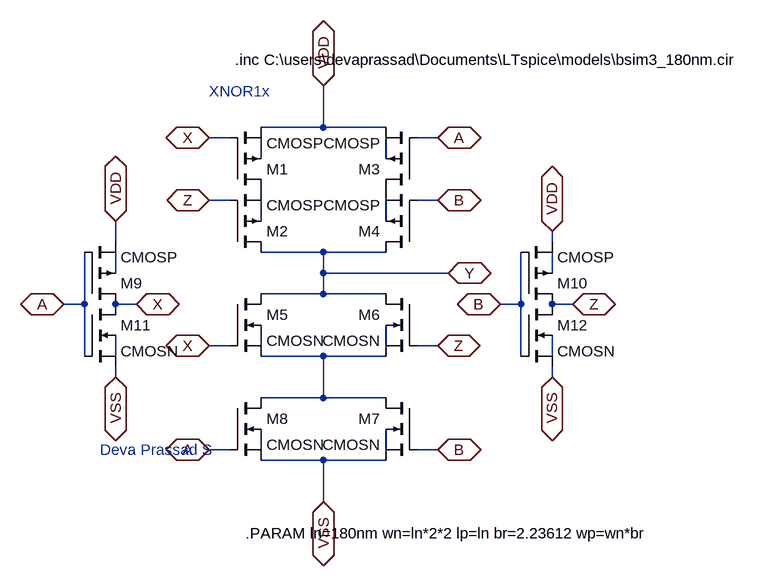
[diagram p0: schematic xnor1x.asc]
xnor1x.asc, the LTspice schematic file:
Version 4.1
SHEET 1 880 756
WIRE 96 96 96 32
WIRE 96 96 0 96
WIRE 192 96 96 96
WIRE -48 112 -80 112
WIRE 272 112 240 112
WIRE 0 144 0 112
WIRE 192 144 192 112
WIRE -48 208 -80 208
WIRE 272 208 240 208
WIRE 0 240 0 208
WIRE 192 240 192 208
WIRE -224 272 -224 240
WIRE 448 272 448 256
WIRE 96 288 0 288
WIRE 192 288 96 288
WIRE -224 320 -224 288
WIRE 96 320 96 288
WIRE 288 320 96 320
WIRE 448 320 448 288
WIRE 96 352 96 320
WIRE 96 352 0 352
WIRE 192 352 96 352
WIRE -272 368 -272 288
WIRE -272 368 -304 368
WIRE -192 368 -224 368
WIRE 400 368 400 288
WIRE 400 368 368 368
WIRE 480 368 448 368
WIRE -48 432 -80 432
WIRE 0 432 0 400
WIRE 192 432 192 400
WIRE 272 432 240 432
WIRE -272 448 -272 368
WIRE -224 448 -224 416
WIRE 96 448 0 448
WIRE 192 448 96 448
WIRE 400 448 400 368
WIRE 448 448 448 416
WIRE -224 480 -224 464
WIRE 448 480 448 464
WIRE 96 512 96 448
WIRE 96 512 0 512
WIRE 192 512 96 512
WIRE -48 592 -80 592
WIRE 0 592 0 560
WIRE 192 592 192 560
WIRE 272 592 240 592
WIRE 96 608 0 608
WIRE 192 608 96 608
WIRE 96 672 96 608
FLAG 288 320 Y
IOPIN 288 320 BiDir
FLAG 96 32 VDD
IOPIN 96 32 BiDir
FLAG 96 672 VSS
IOPIN 96 672 BiDir
FLAG -192 368 X
IOPIN -192 368 BiDir
FLAG -224 240 VDD
IOPIN -224 240 BiDir
FLAG -224 480 VSS
IOPIN -224 480 BiDir
FLAG -304 368 A
IOPIN -304 368 BiDir
FLAG 480 368 Z
IOPIN 480 368 BiDir
FLAG 448 256 VDD
IOPIN 448 256 BiDir
FLAG 368 368 B
IOPIN 368 368 BiDir
FLAG 448 480 VSS
IOPIN 448 480 BiDir
FLAG -80 208 Z
IOPIN -80 208 BiDir
FLAG -80 112 X
IOPIN -80 112 BiDir
FLAG 272 112 A
IOPIN 272 112 BiDir
FLAG 272 208 B
IOPIN 272 208 BiDir
FLAG 272 432 Z
IOPIN 272 432 BiDir
FLAG 272 592 B
IOPIN 272 592 BiDir
FLAG -80 592 A
IOPIN -80 592 BiDir
FLAG -80 432 X
IOPIN -80 432 BiDir
SYMBOL pmos4 -48 192 M180
SYMATTR InstName M1
SYMATTR Value CMOSP
SYMATTR Value2 l={lp} w={wp} ad={lp*wp} as={lp*wp} pd={2*lp+wp} ps={2*lp+wp}
SYMBOL pmos4 -48 288 M180
SYMATTR InstName M2
SYMATTR Value CMOSP
SYMATTR Value2 l={lp} w={wp} ad={lp*wp} as={lp*wp} pd={2*lp+wp} ps={2*lp+wp}
SYMBOL pmos4 240 192 R180
SYMATTR InstName M3
SYMATTR Value CMOSP
SYMATTR Value2 l={lp} w={wp} ad={lp*wp} as={lp*wp} pd={2*lp+wp} ps={2*lp+wp}
SYMBOL pmos4 240 288 R180
SYMATTR InstName M4
SYMATTR Value CMOSP
SYMATTR Value2 l={lp} w={wp} ad={lp*wp} as={lp*wp} pd={2*lp+wp} ps={2*lp+wp}
SYMBOL nmos4 -48 352 R0
SYMATTR InstName M5
SYMATTR Value CMOSN
SYMATTR Value2 l={ln} w={wn} ad={ln*wn} as={ln*wn} pd={2*ln+wn} ps={2*ln+wn}
SYMBOL nmos4 240 352 M0
SYMATTR InstName M6
SYMATTR Value CMOSN
SYMATTR Value2 l={ln} w={wn} ad={ln*wn} as={ln*wn} pd={2*ln+wn} ps={2*ln+wn}
SYMBOL nmos4 240 512 M0
SYMATTR InstName M7
SYMATTR Value CMOSN
SYMATTR Value2 l={ln} w={wn} ad={ln*wn} as={ln*wn} pd={2*ln+wn} ps={2*ln+wn}
SYMBOL nmos4 -48 512 R0
SYMATTR InstName M8
SYMATTR Value CMOSN
SYMATTR Value2 l={ln} w={wn} ad={ln*wn} as={ln*wn} pd={2*ln+wn} ps={2*ln+wn}
SYMBOL pmos4 -272 368 M180
SYMATTR InstName M9
SYMATTR Value CMOSP
SYMATTR Value2 l={lp} w={wp} ad={lp*wp} as={lp*wp} pd={2*lp+wp} ps={2*lp+wp}
SYMBOL pmos4 400 368 M180
SYMATTR InstName M10
SYMATTR Value CMOSP
SYMATTR Value2 l={lp} w={wp} ad={lp*wp} as={lp*wp} pd={2*lp+wp} ps={2*lp+wp}
SYMBOL nmos4 -272 368 R0
SYMATTR InstName M11
SYMATTR Value CMOSN
SYMATTR Value2 l={ln} w={wn} ad={ln*wn} as={ln*wn} pd={2*ln+wn} ps={2*ln+wn}
SYMBOL nmos4 400 368 R0
SYMATTR InstName M12
SYMATTR Value CMOSN
SYMATTR Value2 l={ln} w={wn} ad={ln*wn} as={ln*wn} pd={2*ln+wn} ps={2*ln+wn}
TEXT -80 40 Left 2 ;XNOR1x
TEXT -248 592 Left 2 ;Deva Prassad S
TEXT -24 720 Left 2 !.PARAM ln=180nm wn=ln*2*2 lp=ln br=2.23612 wp=wn*br
TEXT -40 -8 Left 2 !.inc C:\\users\\devaprassad\\Documents\\LTspice\\models\\bsim3_180nm.cir

The netlist it stands for:
* xnor1x.asc
M1 P001 X VDD N001 CMOSP l={lp} w={wp} ad={lp*wp} as={lp*wp} pd={2*lp+wp} ps={2*lp+wp}
M2 Y Z P001 N003 CMOSP l={lp} w={wp} ad={lp*wp} as={lp*wp} pd={2*lp+wp} ps={2*lp+wp}
M3 P002 A VDD N002 CMOSP l={lp} w={wp} ad={lp*wp} as={lp*wp} pd={2*lp+wp} ps={2*lp+wp}
M4 Y B P002 N004 CMOSP l={lp} w={wp} ad={lp*wp} as={lp*wp} pd={2*lp+wp} ps={2*lp+wp}
M5 Y X N010 N007 CMOSN l={ln} w={wn} ad={ln*wn} as={ln*wn} pd={2*ln+wn} ps={2*ln+wn}
M6 Y Z N010 N008 CMOSN l={ln} w={wn} ad={ln*wn} as={ln*wn} pd={2*ln+wn} ps={2*ln+wn}
M7 N010 B VSS N013 CMOSN l={ln} w={wn} ad={ln*wn} as={ln*wn} pd={2*ln+wn} ps={2*ln+wn}
M8 N010 A VSS N012 CMOSN l={ln} w={wn} ad={ln*wn} as={ln*wn} pd={2*ln+wn} ps={2*ln+wn}
M9 X A VDD N005 CMOSP l={lp} w={wp} ad={lp*wp} as={lp*wp} pd={2*lp+wp} ps={2*lp+wp}
M10 Z B VDD N006 CMOSP l={lp} w={wp} ad={lp*wp} as={lp*wp} pd={2*lp+wp} ps={2*lp+wp}
M11 X A VSS N009 CMOSN l={ln} w={wn} ad={ln*wn} as={ln*wn} pd={2*ln+wn} ps={2*ln+wn}
M12 Z B VSS N011 CMOSN l={ln} w={wn} ad={ln*wn} as={ln*wn} pd={2*ln+wn} ps={2*ln+wn}
.model NMOS NMOS
.model PMOS PMOS
.lib standard.mos
* XNOR1x
* Deva Prassad S
.PARAM ln=180nm wn=ln*2*2 lp=ln br=2.23612 wp=wn*br
.inc C:\users\devaprassad\Documents\LTspice\models\bsim3_180nm.cir
.backanno
.end